# Altium project PCB_Project.PrjPcb
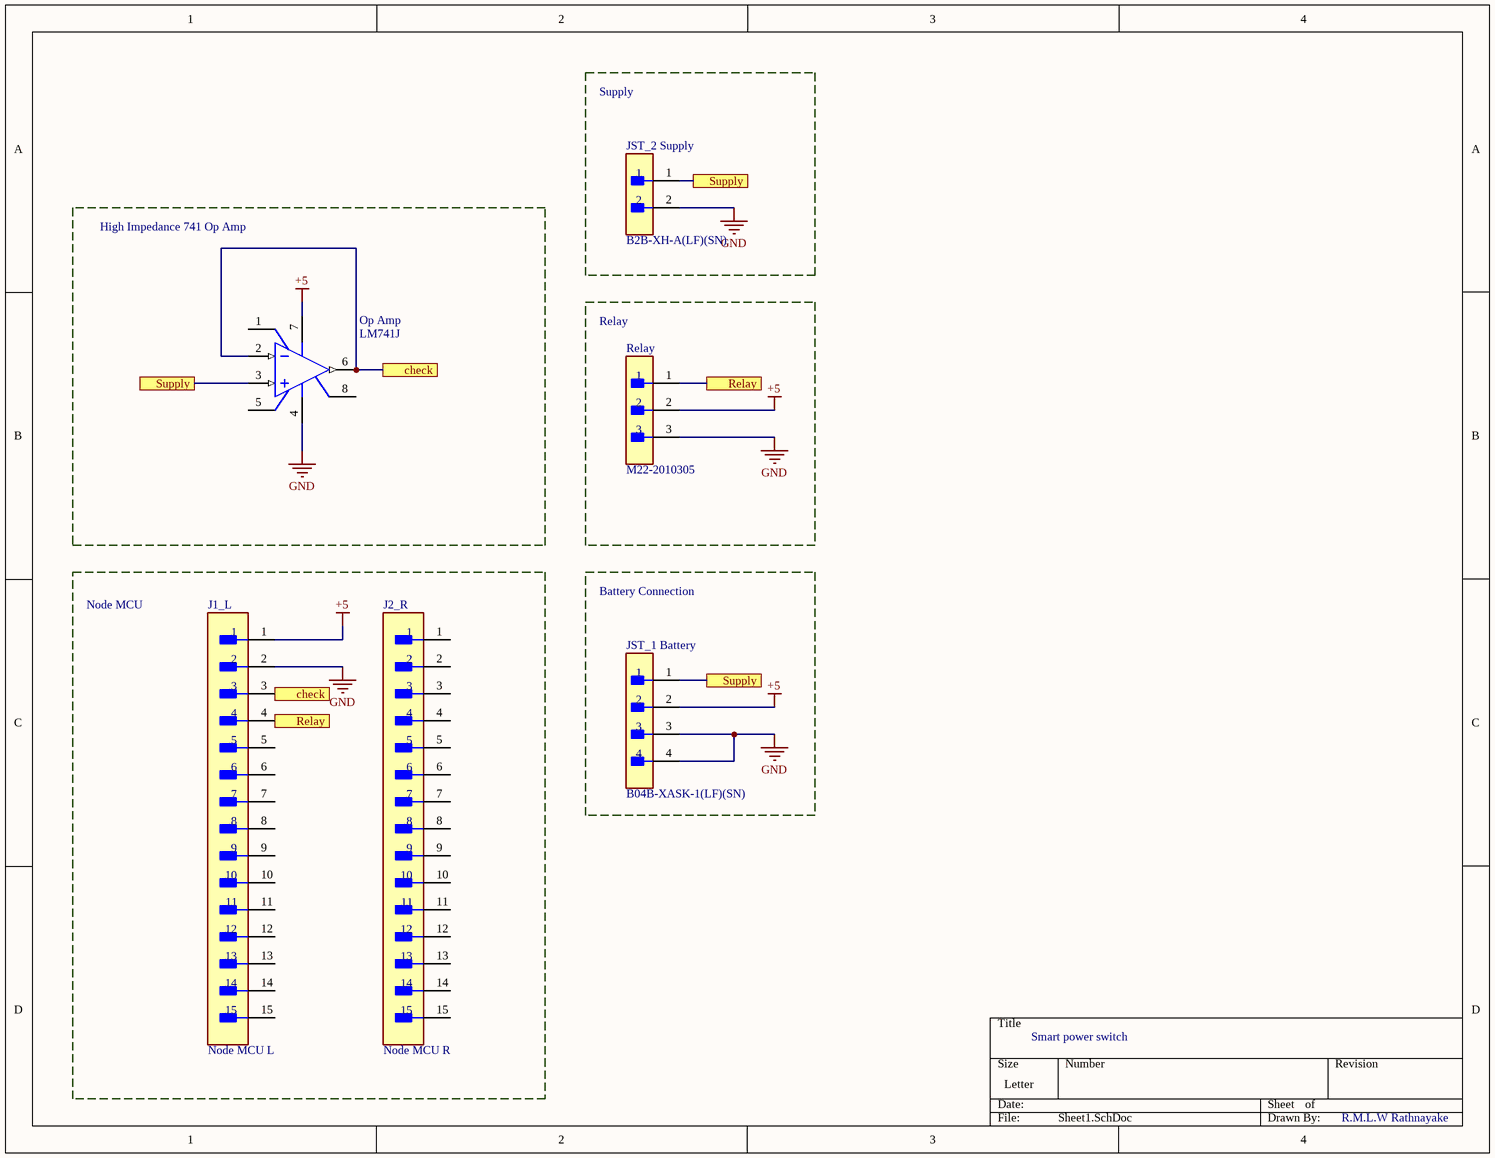
[diagram p0: Sheet1.SchDoc]
1 sheet, 6 parts. Net scope: flat (ports and power ports of the same name join across sheets).
Board file: PCB1.PcbDoc

## Sheet Sheet1.SchDoc
size Letter; SheetNumber: 1; SheetTotal: 1

### Parts
J1_L  Node MCU L  [FP-61301511121-MFG]
J2_R  Node MCU R  [FP-61301511121-MFG]
JST_1_Battery  B04B-XASK-1(LF)(SN)  [FP-B04B-XASK-1_LF_SN-MFG]
JST_2_Supply  B2B-XH-A(LF)(SN)  [FP-B2B-XH-A_LF_SN-MFG]
Op_Amp  LM741J  [NAB0008A]
Relay  M22-2010305  [FP-M22-2010305-MFG]

### Blocks framed on the sheet
Supply: JST_2_Supply
High Impedance 741 Op Amp: Op_Amp
Relay: Relay
Node MCU: J1_L J2_R
Battery Connection: JST_1_Battery

### Ports
check, Relay, Supply

### Nets
+5: J1_L.1 JST_1_Battery.2 Op_Amp.7(V+) Relay.2
GND: J1_L.2 JST_1_Battery.3 JST_1_Battery.4 JST_2_Supply.2 Op_Amp.4(V-) Relay.3
NetJ1_L_3: J1_L.3 Op_Amp.2(IN-) Op_Amp.6(OUT) ; port check
NetJ1_L_4: J1_L.4 Relay.1 ; port Relay
NetJST_1_Battery_1: JST_1_Battery.1 JST_2_Supply.1 Op_Amp.3(IN+) ; port Supply

Not connected (* = marked no-connect by the designer): J1_L 5 6 7 8 9 10 11 12 13 14 15; J2_R 1 2 3 4 5 6 7 8 9 10 11 12 13 14 15; Op_Amp 1(OFS_NULL) 5(OFS_NULL) 8(NC)

### Notes on the sheet
- Smart power switch
- R.M.L.W Rathnayake

### Library data of the parts
J1_L = CMP-207987-000006-1: CONN HEADER VERT 15POS 2.54MM; Voltage Rating: 250V; Pitch: 0.1inch; Gender: Male; Number of Positions: 15; Mount: Through Hole; Connector Type: Header; Insulation Color: Black; Contact Material: Copper Alloy; Color: Black; Flammability Rating: UL94 V-0; Min Operating Temperature: -40°C; RoHS Compliant: Yes; Termination: Solder; Packaging: Bulk; Series: WR-PHD; Contact Shape: Square; Contact Plating: Gold; Contact Mating Length: 0.236inch; Number of Rows: 1; Fastening Type: Pull; Contact Type: Male Pin; Contact Finish - Mating: GOLD; Insulation Material: Nylon; Number of Contacts: 15; Max Operating Temperature: 105°C
J2_R = CMP-207987-000006-1: ESP8266; Voltage Rating: 250V; Connector Type: Header; Pitch: 0.1inch; Gender: Male; Number of Positions: 15; Mount: Through Hole; Insulation Color: Black; Contact Material: Copper Alloy; Color: Black; Flammability Rating: UL94 V-0; Min Operating Temperature: -40°C; RoHS Compliant: Yes; Termination: Solder; Packaging: Bulk; Series: WR-PHD; Contact Shape: Square; Contact Plating: Gold; Contact Mating Length: 0.236inch; Number of Rows: 1; Fastening Type: Pull; Contact Type: Male Pin; Contact Finish - Mating: GOLD; Insulation Material: Nylon; Number of Contacts: 15; Max Operating Temperature: 105°C
JST_1_Battery = CMP-17439-000018-1: CONN HEADER VERT 4POS 2.5MM; Manufacturer: JST; Current Rating: 3A; Voltage Rating: 250V; Conn Orientation: Straight; Conn Gender: Male; Number Of Contacts: 4; ComponentLink2Description: Datasheet; Package: B04B-XASK-1(LF)(SN); Octopart: https://octopart.com/b04b-xask-1%28lf%29%28sn%29-jst-3990149; Pitch: 2.5mm; Device Class L1: Connectors; RoHS: TRUE; Device Class L3: unset; Manufacturer Part Number: B04B-XASK-1(LF)(SN); Temperature Range High: +85°C; Height: 8.8mm; Lead Free: Yes; Category: Conn; Temperature: -25°C to +85°C; Digikey Description: CONN HEADER VERT 4POS 2.5MM; Temperature Range Low: -25°C; ComponentLink2URL: http://www.jst-mfg.com/product/pdf/eng/eXA1.pdf; Contact Material: Tin,Copper; Device Class L2: Headers and Wire Housings; Automotive: No; Number Of Rows: 1
JST_2_Supply = CMP-2000-05888-3: CONN HEADER VERT 2POS 2.5MM; Current Rating: 3A; Voltage Rating: 250V; Number of Contacts: 2; Contact Resistance: 20mR; Wire/Cable Gauge: 22AWG; Insulation Resistance: 1GR; Connector Type: Male Pin; Packaging: Bulk; Contact Material: Brass; Lead Free: Lead Free; Orientation: Straight; Contact Plating: Tin; Max Current Rating: 3A; Termination: Solder; Fastening Type: Detent; Depth: 5.75mm; Housing Material: Polyamide; REACH SVHC: No SVHC; Series: XH; Voltage Rating (AC): 250V; Number of Positions: 2; Color: Natural; Contact Type: Male Pin; Max Voltage Rating (DC): 250V; Pitch: 2.5mm; Lead Pitch: 2.5mm; Mount: Through Hole; Max Operating Temperature: 85°C; Length: 7.4mm; Max Voltage Rating (AC): 250V; Min Operating Temperature: -25°C; Number of Rows: 1; Housing Color: White
Op_Amp = CMP-0055-00160-3: Operational Amplifier, 8-pin CerDIP; Manufacturer: Texas Instruments; PackageTopMarking: NSUZXYTT*LM741J; CompType: Amplifiers; PowerWise: N; PackageDescription: Cerdip, .400 x .310in Body, 8 Lead, .300in Centers, .100in Pitch; PinCount: 8; RoHS: N; Package Reference: NAB0008A; ComponentLink1Description: Datasheet URL; ComponentLink1URL: http://www.ti.com/general/docs/lit/getliterature.tsp?genericPartNumber=LM741&fileType=pdf
Relay = CMP-15831-000100-1: CONN HEADER VERT 3POS 2MM; Voltage Rating (AC): 250V; Current Rating: 1A; Contact Resistance: 20mR; Number of Positions: 3; Mated Stacking Heights: 8.6mm; Voltage Rating: 650V; Insulation Resistance: 10GR; Connector Type: Male Pin; Contact Shape: Square; Min Operating Temperature: -55°C; Lead Pitch: 2mm; Contact Plating: Gold; Pitch: 2mm; Max Operating Temperature: 105°C; Color: Black; Series: M22; Orientation: Straight; Number of Contacts: 3; Max Current Rating: 1A; Contact Material: Bronze; Packaging: Bulk; Housing Color: Black; Housing Material: Nylon; Mount: Through Hole; Case/Package: SIL; Working Voltage: 250V; Reach SVHC Compliant: Yes; Number of Rows: 1; Package Quantity: 1000; Insulation Material: Nylon; Length: 6mm; Contact Finish - Mating: GOLD; Depth: 2mm; Contact Type: Male Pin; Insulation Color: Black; Termination: Solder; RoHS Compliant: Yes; Radiation Hardening: No; Flammability Rating: UL94 V-0; Contact Mating Length: 0.138inch; Fastening Type: Pull